# Altium schematic sheet Channel.SchDoc
size A1; SheetNumber: 2; SheetTotal: 2
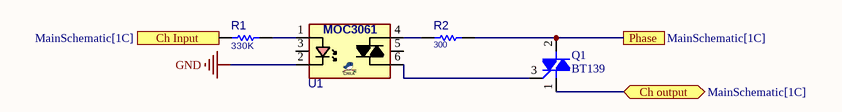
[diagram p0: Channel.SchDoc]

## Parts
Q1  BT139  [TO220_3]
R1  330K  [R1206]
R2  300  [R025W_AX_VER]
U1  MOC3061  [DIP_6]  (value not drawn)

## Ports
Ch Input (in, see MainSchematic[1C]), Ch output (bidir, see MainSchematic[1C]), Phase (see MainSchematic[1C])

## Nets
GND: U1.2(K)
Ch Input: R1.2 ; port Ch Input
Ch output: Q1.1(T1) ; port Ch output
Phase: Q1.2(T2) R2.2 ; port Phase
NetQ1_3: Q1.3(G) U1.6(A/K)
NetR1_1: R1.1 U1.1(A)
NetR2_1: R2.1 U1.4(A/K)

Not connected (* = marked no-connect by the designer): U1 3(NC) 5(NC)

## Library data of the parts
Q1 = TRIAC: Triac, 600V, 4A, TO-220, Silicon Bidirectional Thyristor; VALUE: BT136; MANF_P#: *; MANF: *; PRICE: toman@PAYA
R1 = RES_SMD: RESISTOR, SMD; PARAM: -W; DESC: DESCRIPTION; DIST#: MOUSER; PARAM2: 1%; MANF_P#: -; MANF: -; ASSEMBLY: ASSEMBLY; PRICE: 100= 0.5$; VALUE: 330K
R2 = RES_THD: RESISTOR, THD; MANF_P#: RK73H1ETTP4701F; MANF: KOA SPEER; PARAM: 0.063W; DESC: DESCRIPTION; DIST#: MOUSER; PARAM2: 1%; ASSEMBLY: ASSEMBLY; PRICE: 100= 0.5$; VALUE: 300
U1 = OPT_TRIAC6P_MOC3061: OPTOTRIAC, 600v/1A, 6v In; PARAM2: 300mW, -40~85°C; PARAM: 6v/60mA IN/ 600v/1A out; MANF_P#: MOC3061; PRICE: 5t@paya; VALUE: MOC3061; PACKAGE: DIP-6